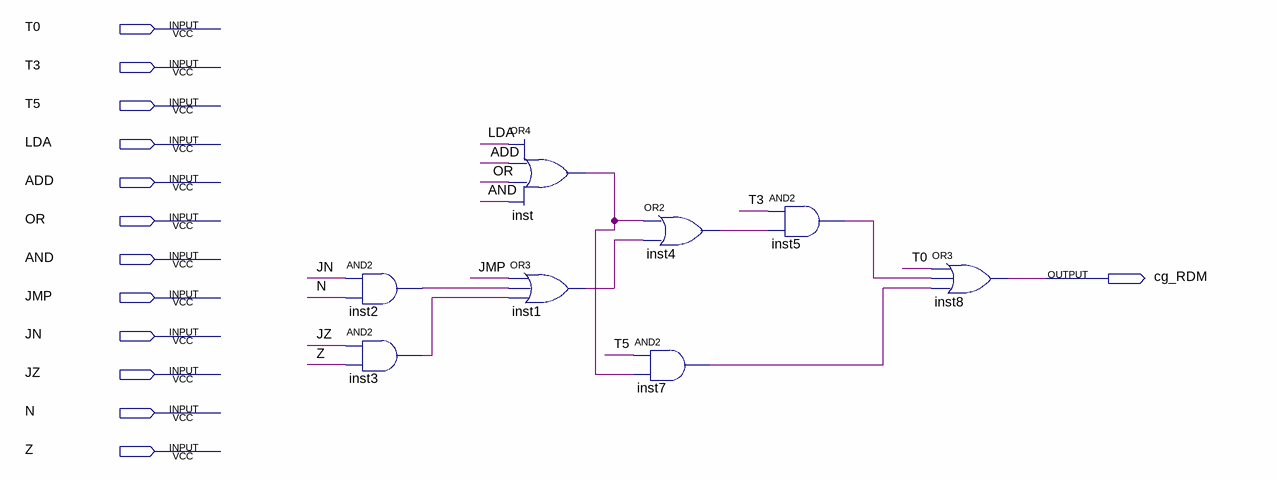
[diagram p0: schematic sheet]
// Quartus schematic abk_carga_RDM.bdf as structural Verilog: 8 symbols, 13 pins
module abk_carga_RDM (
  input  T0,
  input  T3,
  input  T5,
  input  LDA,
  input  ADD,
  input  OR,
  input  AND,
  input  JMP,
  input  JN,
  input  JZ,
  input  N,
  input  Z,
  output cg_RDM
);

  wire inst1_out, inst2_out, inst3_out, inst4_out, inst5_out, inst7_out, inst_out;

  and inst2 (inst2_out, JN, N);
  and inst3 (inst3_out, JZ, Z);
  or inst (inst_out, LDA, ADD, OR, AND);
  or inst1 (inst1_out, JMP, inst2_out, inst3_out);
  and inst7 (inst7_out, T5, inst_out);
  or inst4 (inst4_out, inst_out, inst1_out);
  and inst5 (inst5_out, T3, inst4_out);
  or inst8 (cg_RDM, T0, inst5_out, inst7_out);
endmodule
